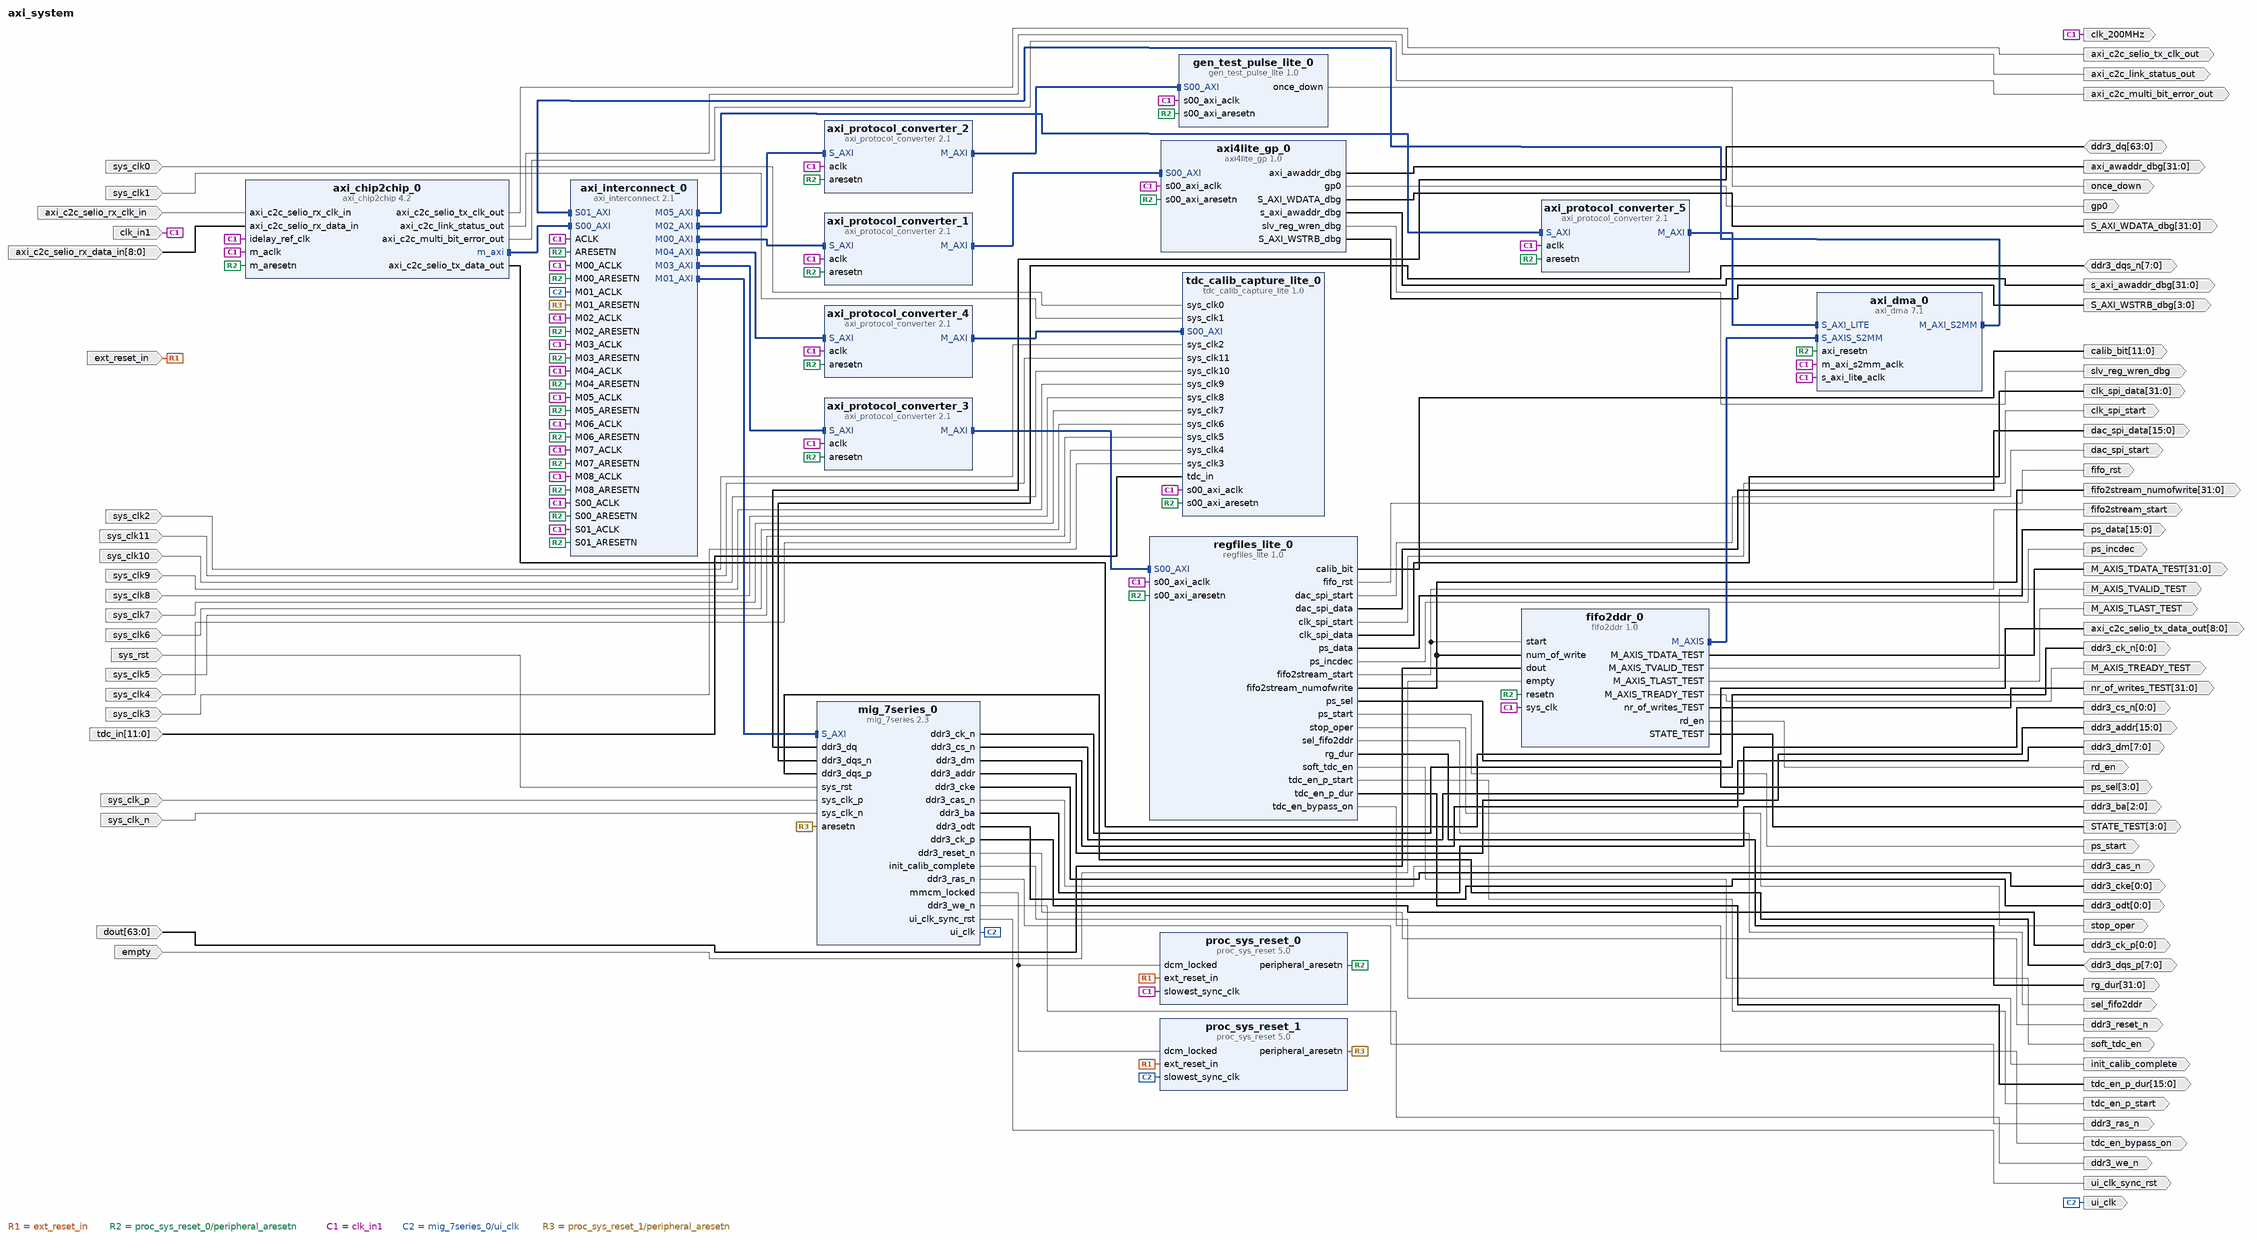
[diagram p0: block diagram of the top level]
# Vivado block design axi_system, Vivado 2015.2
create_bd_design axi_system

create_bd_port -dir I -type rst ext_reset_in
create_bd_port -dir I -type clk axi_c2c_selio_rx_clk_in
set_property -dict {CONFIG.FREQ_HZ 200000000} [get_bd_ports axi_c2c_selio_rx_clk_in]
create_bd_port -dir O -type clk axi_c2c_selio_tx_clk_out
create_bd_port -dir O axi_c2c_link_status_out
create_bd_port -dir O axi_c2c_multi_bit_error_out
create_bd_port -dir O gp0
create_bd_port -dir O slv_reg_wren_dbg
create_bd_port -dir O -from 31 -to 0 S_AXI_WDATA_dbg
create_bd_port -dir O -from 3 -to 0 S_AXI_WSTRB_dbg
create_bd_port -dir O -from 31 -to 0 axi_awaddr_dbg
create_bd_port -dir O -from 31 -to 0 s_axi_awaddr_dbg
create_bd_port -dir O init_calib_complete
create_bd_port -dir I -type rst sys_rst
create_bd_port -dir IO -from 63 -to 0 ddr3_dq
create_bd_port -dir O -from 0 -to 0 ddr3_odt
create_bd_port -dir O -from 7 -to 0 ddr3_dm
create_bd_port -dir O -from 0 -to 0 ddr3_cs_n
create_bd_port -dir O -from 0 -to 0 ddr3_cke
create_bd_port -dir O -from 0 -to 0 ddr3_ck_n
create_bd_port -dir O -from 0 -to 0 ddr3_ck_p
create_bd_port -dir O ddr3_reset_n
create_bd_port -dir O ddr3_we_n
create_bd_port -dir O ddr3_cas_n
create_bd_port -dir O ddr3_ras_n
create_bd_port -dir O -from 2 -to 0 ddr3_ba
create_bd_port -dir O -from 15 -to 0 ddr3_addr
create_bd_port -dir IO -from 7 -to 0 ddr3_dqs_n
create_bd_port -dir IO -from 7 -to 0 ddr3_dqs_p
create_bd_port -dir O once_down
create_bd_port -dir O fifo_rst
create_bd_port -dir O ps_start
create_bd_port -dir O -from 15 -to 0 ps_data
create_bd_port -dir O -from 3 -to 0 ps_sel
create_bd_port -dir O ps_incdec
create_bd_port -dir O stop_oper
create_bd_port -dir O fifo2stream_start
create_bd_port -dir O -from 31 -to 0 fifo2stream_numofwrite
create_bd_port -dir O sel_fifo2ddr
create_bd_port -dir O soft_tdc_en
create_bd_port -dir O -from 31 -to 0 rg_dur
create_bd_port -dir O tdc_en_p_start
create_bd_port -dir O -from 15 -to 0 tdc_en_p_dur
create_bd_port -dir I sys_clk0
create_bd_port -dir I sys_clk1
create_bd_port -dir I sys_clk2
create_bd_port -dir I sys_clk11
create_bd_port -dir I sys_clk10
create_bd_port -dir I sys_clk9
create_bd_port -dir I sys_clk8
create_bd_port -dir I sys_clk7
create_bd_port -dir I sys_clk6
create_bd_port -dir I sys_clk5
create_bd_port -dir I sys_clk4
create_bd_port -dir I sys_clk3
create_bd_port -dir I -from 11 -to 0 tdc_in
create_bd_port -dir I -from 63 -to 0 dout
create_bd_port -dir I empty
create_bd_port -dir O rd_en
create_bd_port -dir O M_AXIS_TVALID_TEST
create_bd_port -dir O -from 31 -to 0 M_AXIS_TDATA_TEST
create_bd_port -dir O M_AXIS_TREADY_TEST
create_bd_port -dir O M_AXIS_TLAST_TEST
create_bd_port -dir O -from 3 -to 0 STATE_TEST
create_bd_port -dir O -from 31 -to 0 nr_of_writes_TEST
create_bd_port -dir O -from 8 -to 0 axi_c2c_selio_tx_data_out
create_bd_port -dir I -from 8 -to 0 axi_c2c_selio_rx_data_in
create_bd_port -dir O -from 11 -to 0 calib_bit
create_bd_port -dir O tdc_en_bypass_on
create_bd_port -dir O dac_spi_start
create_bd_port -dir O -from 15 -to 0 dac_spi_data
create_bd_port -dir I -type clk clk_in1
set_property -dict [list \
  CONFIG.FREQ_HZ 200000000 \
  CONFIG.PHASE 0 \
  CONFIG.CLK_DOMAIN axi_system_mig_7series_0_0_ui_clk \
] [get_bd_ports clk_in1]
create_bd_port -dir O -type clk clk_200MHz
create_bd_port -dir O ui_clk
create_bd_port -dir O -type rst ui_clk_sync_rst
create_bd_port -dir O clk_spi_start
create_bd_port -dir O -from 31 -to 0 clk_spi_data
create_bd_port -dir I sys_clk_p
create_bd_port -dir I sys_clk_n

create_bd_cell -type ip -vlnv fedadesign.com:fedalib:axi4lite_gp:1.0 axi4lite_gp_0
create_bd_cell -type ip -vlnv fedadesign.com:fedalib:gen_test_pulse_lite:1.0 gen_test_pulse_lite_0
create_bd_cell -type ip -vlnv fedadesign.com:fedalib:tdc_calib_capture_lite:1.0 tdc_calib_capture_lite_0
create_bd_cell -type ip -vlnv xilinx.com:ip:axi_chip2chip:4.2 axi_chip2chip_0
set_property -dict [list \
  CONFIG.C_AXI_WUSER_WIDTH 4 \
  CONFIG.C_AXI_ID_WIDTH 6 \
  CONFIG.C_AXI_DATA_WIDTH 32 \
  CONFIG.C_INCLUDE_AXILITE 0 \
  CONFIG.C_INTERFACE_MODE 2 \
  CONFIG.C_INTERFACE_TYPE 1 \
  CONFIG.C_COMMON_CLK 0 \
  CONFIG.C_MASTER_FPGA 0 \
  CONFIG.C_ECC_ENABLE true \
  CONFIG.C_AURORA_WIDTH 2 \
  CONFIG.C_USE_DIFF_IO false \
  CONFIG.C_USE_DIFF_CLK false \
  CONFIG.C_DISABLE_CLK_SHIFT false \
  CONFIG.C_DISABLE_DESKEW false \
] [get_bd_cells axi_chip2chip_0]
create_bd_cell -type ip -vlnv xilinx.com:ip:axi_dma:7.1 axi_dma_0
set_property -dict [list \
  CONFIG.c_include_sg 0 \
  CONFIG.c_sg_length_width 23 \
  CONFIG.c_micro_dma 0 \
  CONFIG.c_include_mm2s 0 \
  CONFIG.c_s2mm_burst_size 128 \
] [get_bd_cells axi_dma_0]
create_bd_cell -type ip -vlnv xilinx.com:ip:axi_interconnect:2.1 axi_interconnect_0
set_property -dict [list \
  CONFIG.NUM_SI 2 \
  CONFIG.NUM_MI 9 \
  CONFIG.STRATEGY 2 \
  CONFIG.ENABLE_ADVANCED_OPTIONS 1 \
  CONFIG.ENABLE_PROTOCOL_CHECKERS 0 \
  CONFIG.SYNCHRONIZATION_STAGES 2 \
  CONFIG.M01_HAS_DATA_FIFO 2 \
] [get_bd_cells axi_interconnect_0]
create_bd_cell -type ip -vlnv xilinx.com:ip:axi_protocol_converter:2.1 axi_protocol_converter_1
create_bd_cell -type ip -vlnv xilinx.com:ip:axi_protocol_converter:2.1 axi_protocol_converter_2
create_bd_cell -type ip -vlnv xilinx.com:ip:axi_protocol_converter:2.1 axi_protocol_converter_3
create_bd_cell -type ip -vlnv xilinx.com:ip:axi_protocol_converter:2.1 axi_protocol_converter_4
create_bd_cell -type ip -vlnv xilinx.com:ip:axi_protocol_converter:2.1 axi_protocol_converter_5
create_bd_cell -type ip -vlnv xilinx.com:ip:mig_7series:2.3 mig_7series_0
set_property -dict [list \
  CONFIG.XML_INPUT_FILE mig_a.prj \
  CONFIG.RESET_BOARD_INTERFACE Custom \
  CONFIG.BOARD_MIG_PARAM Custom \
] [get_bd_cells mig_7series_0]
create_bd_cell -type ip -vlnv xilinx.com:ip:proc_sys_reset:5.0 proc_sys_reset_0
create_bd_cell -type ip -vlnv fedadesign.com:fedalib:regfiles_lite:1.0 regfiles_lite_0
create_bd_cell -type ip -vlnv fedadesign.com:fedalib:fifo2ddr:1.0 fifo2ddr_0
create_bd_cell -type ip -vlnv xilinx.com:ip:proc_sys_reset:5.0 proc_sys_reset_1

# ---- connections ----

connect_bd_intf_net [get_bd_intf_pins axi_protocol_converter_1/M_AXI] [get_bd_intf_pins axi4lite_gp_0/S00_AXI]
connect_bd_intf_net [get_bd_intf_pins axi_protocol_converter_1/S_AXI] [get_bd_intf_pins axi_interconnect_0/M00_AXI]
connect_bd_intf_net [get_bd_intf_pins mig_7series_0/S_AXI] [get_bd_intf_pins axi_interconnect_0/M01_AXI]
connect_bd_intf_net [get_bd_intf_pins axi_protocol_converter_2/M_AXI] [get_bd_intf_pins gen_test_pulse_lite_0/S00_AXI]
connect_bd_intf_net [get_bd_intf_pins axi_protocol_converter_2/S_AXI] [get_bd_intf_pins axi_interconnect_0/M02_AXI]
connect_bd_intf_net [get_bd_intf_pins axi_protocol_converter_3/M_AXI] [get_bd_intf_pins regfiles_lite_0/S00_AXI]
connect_bd_intf_net [get_bd_intf_pins axi_protocol_converter_3/S_AXI] [get_bd_intf_pins axi_interconnect_0/M03_AXI]
connect_bd_intf_net [get_bd_intf_pins axi_protocol_converter_4/M_AXI] [get_bd_intf_pins tdc_calib_capture_lite_0/S00_AXI]
connect_bd_intf_net [get_bd_intf_pins axi_protocol_converter_4/S_AXI] [get_bd_intf_pins axi_interconnect_0/M04_AXI]
connect_bd_intf_net [get_bd_intf_pins axi_dma_0/M_AXI_S2MM] [get_bd_intf_pins axi_interconnect_0/S01_AXI]
connect_bd_intf_net [get_bd_intf_pins fifo2ddr_0/M_AXIS] [get_bd_intf_pins axi_dma_0/S_AXIS_S2MM]
connect_bd_intf_net [get_bd_intf_pins axi_protocol_converter_5/M_AXI] [get_bd_intf_pins axi_dma_0/S_AXI_LITE]
connect_bd_intf_net [get_bd_intf_pins axi_protocol_converter_5/S_AXI] [get_bd_intf_pins axi_interconnect_0/M05_AXI]
connect_bd_intf_net [get_bd_intf_pins axi_interconnect_0/S00_AXI] [get_bd_intf_pins axi_chip2chip_0/m_axi]
connect_bd_net [get_bd_ports ext_reset_in] [get_bd_pins proc_sys_reset_0/ext_reset_in] [get_bd_pins proc_sys_reset_1/ext_reset_in]
connect_bd_net [get_bd_ports axi_c2c_selio_rx_clk_in] [get_bd_pins axi_chip2chip_0/axi_c2c_selio_rx_clk_in]
connect_bd_net [get_bd_pins axi_chip2chip_0/axi_c2c_selio_tx_clk_out] [get_bd_ports axi_c2c_selio_tx_clk_out]
connect_bd_net [get_bd_pins axi_chip2chip_0/axi_c2c_link_status_out] [get_bd_ports axi_c2c_link_status_out]
connect_bd_net [get_bd_pins axi_chip2chip_0/axi_c2c_multi_bit_error_out] [get_bd_ports axi_c2c_multi_bit_error_out]
connect_bd_net [get_bd_pins axi4lite_gp_0/gp0] [get_bd_ports gp0]
connect_bd_net [get_bd_pins axi4lite_gp_0/slv_reg_wren_dbg] [get_bd_ports slv_reg_wren_dbg]
connect_bd_net [get_bd_pins axi4lite_gp_0/S_AXI_WDATA_dbg] [get_bd_ports S_AXI_WDATA_dbg]
connect_bd_net [get_bd_pins axi4lite_gp_0/S_AXI_WSTRB_dbg] [get_bd_ports S_AXI_WSTRB_dbg]
connect_bd_net [get_bd_pins axi4lite_gp_0/axi_awaddr_dbg] [get_bd_ports axi_awaddr_dbg]
connect_bd_net [get_bd_pins axi4lite_gp_0/s_axi_awaddr_dbg] [get_bd_ports s_axi_awaddr_dbg]
connect_bd_net [get_bd_pins proc_sys_reset_0/peripheral_aresetn] \
  [get_bd_pins axi4lite_gp_0/s00_axi_aresetn] [get_bd_pins gen_test_pulse_lite_0/s00_axi_aresetn] \
  [get_bd_pins tdc_calib_capture_lite_0/s00_axi_aresetn] [get_bd_pins axi_chip2chip_0/m_aresetn] \
  [get_bd_pins axi_dma_0/axi_resetn] [get_bd_pins axi_protocol_converter_1/aresetn] \
  [get_bd_pins axi_protocol_converter_2/aresetn] [get_bd_pins axi_protocol_converter_3/aresetn] \
  [get_bd_pins axi_protocol_converter_4/aresetn] [get_bd_pins axi_protocol_converter_5/aresetn] \
  [get_bd_pins regfiles_lite_0/s00_axi_aresetn] [get_bd_pins fifo2ddr_0/resetn] [get_bd_pins axi_interconnect_0/ARESETN] \
  [get_bd_pins axi_interconnect_0/S00_ARESETN] [get_bd_pins axi_interconnect_0/M00_ARESETN] \
  [get_bd_pins axi_interconnect_0/M02_ARESETN] [get_bd_pins axi_interconnect_0/M03_ARESETN] \
  [get_bd_pins axi_interconnect_0/M04_ARESETN] [get_bd_pins axi_interconnect_0/M05_ARESETN] \
  [get_bd_pins axi_interconnect_0/S01_ARESETN] [get_bd_pins axi_interconnect_0/M06_ARESETN] \
  [get_bd_pins axi_interconnect_0/M07_ARESETN] [get_bd_pins axi_interconnect_0/M08_ARESETN]
connect_bd_net [get_bd_pins mig_7series_0/init_calib_complete] [get_bd_ports init_calib_complete]
connect_bd_net [get_bd_ports sys_rst] [get_bd_pins mig_7series_0/sys_rst]
connect_bd_net [get_bd_ports ddr3_dq] [get_bd_pins mig_7series_0/ddr3_dq]
connect_bd_net [get_bd_pins mig_7series_0/ddr3_odt] [get_bd_ports ddr3_odt]
connect_bd_net [get_bd_pins mig_7series_0/ddr3_dm] [get_bd_ports ddr3_dm]
connect_bd_net [get_bd_pins mig_7series_0/ddr3_cs_n] [get_bd_ports ddr3_cs_n]
connect_bd_net [get_bd_pins mig_7series_0/ddr3_cke] [get_bd_ports ddr3_cke]
connect_bd_net [get_bd_pins mig_7series_0/ddr3_ck_n] [get_bd_ports ddr3_ck_n]
connect_bd_net [get_bd_pins mig_7series_0/ddr3_ck_p] [get_bd_ports ddr3_ck_p]
connect_bd_net [get_bd_pins mig_7series_0/ddr3_reset_n] [get_bd_ports ddr3_reset_n]
connect_bd_net [get_bd_pins mig_7series_0/ddr3_we_n] [get_bd_ports ddr3_we_n]
connect_bd_net [get_bd_pins mig_7series_0/ddr3_cas_n] [get_bd_ports ddr3_cas_n]
connect_bd_net [get_bd_pins mig_7series_0/ddr3_ras_n] [get_bd_ports ddr3_ras_n]
connect_bd_net [get_bd_pins mig_7series_0/ddr3_ba] [get_bd_ports ddr3_ba]
connect_bd_net [get_bd_pins mig_7series_0/ddr3_addr] [get_bd_ports ddr3_addr]
connect_bd_net [get_bd_ports ddr3_dqs_n] [get_bd_pins mig_7series_0/ddr3_dqs_n]
connect_bd_net [get_bd_ports ddr3_dqs_p] [get_bd_pins mig_7series_0/ddr3_dqs_p]
connect_bd_net [get_bd_pins gen_test_pulse_lite_0/once_down] [get_bd_ports once_down]
connect_bd_net [get_bd_pins regfiles_lite_0/fifo_rst] [get_bd_ports fifo_rst]
connect_bd_net [get_bd_pins regfiles_lite_0/ps_start] [get_bd_ports ps_start]
connect_bd_net [get_bd_pins regfiles_lite_0/ps_data] [get_bd_ports ps_data]
connect_bd_net [get_bd_pins regfiles_lite_0/ps_sel] [get_bd_ports ps_sel]
connect_bd_net [get_bd_pins regfiles_lite_0/ps_incdec] [get_bd_ports ps_incdec]
connect_bd_net [get_bd_pins regfiles_lite_0/stop_oper] [get_bd_ports stop_oper]
connect_bd_net [get_bd_pins regfiles_lite_0/fifo2stream_start] [get_bd_ports fifo2stream_start] [get_bd_pins fifo2ddr_0/start]
connect_bd_net [get_bd_pins regfiles_lite_0/fifo2stream_numofwrite] [get_bd_ports fifo2stream_numofwrite] [get_bd_pins fifo2ddr_0/num_of_write]
connect_bd_net [get_bd_pins regfiles_lite_0/sel_fifo2ddr] [get_bd_ports sel_fifo2ddr]
connect_bd_net [get_bd_pins regfiles_lite_0/soft_tdc_en] [get_bd_ports soft_tdc_en]
connect_bd_net [get_bd_pins regfiles_lite_0/rg_dur] [get_bd_ports rg_dur]
connect_bd_net [get_bd_pins regfiles_lite_0/tdc_en_p_start] [get_bd_ports tdc_en_p_start]
connect_bd_net [get_bd_pins regfiles_lite_0/tdc_en_p_dur] [get_bd_ports tdc_en_p_dur]
connect_bd_net -net sys_clk0_1 [get_bd_ports sys_clk0] [get_bd_pins tdc_calib_capture_lite_0/sys_clk0]
connect_bd_net -net sys_clk1_1 [get_bd_ports sys_clk1] [get_bd_pins tdc_calib_capture_lite_0/sys_clk1]
connect_bd_net -net sys_clk2_1 [get_bd_ports sys_clk2] [get_bd_pins tdc_calib_capture_lite_0/sys_clk2]
connect_bd_net -net sys_clk11_1 [get_bd_ports sys_clk11] [get_bd_pins tdc_calib_capture_lite_0/sys_clk11]
connect_bd_net -net sys_clk10_1 [get_bd_ports sys_clk10] [get_bd_pins tdc_calib_capture_lite_0/sys_clk10]
connect_bd_net -net sys_clk9_1 [get_bd_ports sys_clk9] [get_bd_pins tdc_calib_capture_lite_0/sys_clk9]
connect_bd_net -net sys_clk8_1 [get_bd_ports sys_clk8] [get_bd_pins tdc_calib_capture_lite_0/sys_clk8]
connect_bd_net -net sys_clk7_1 [get_bd_ports sys_clk7] [get_bd_pins tdc_calib_capture_lite_0/sys_clk7]
connect_bd_net -net sys_clk6_1 [get_bd_ports sys_clk6] [get_bd_pins tdc_calib_capture_lite_0/sys_clk6]
connect_bd_net -net sys_clk5_1 [get_bd_ports sys_clk5] [get_bd_pins tdc_calib_capture_lite_0/sys_clk5]
connect_bd_net -net sys_clk4_1 [get_bd_ports sys_clk4] [get_bd_pins tdc_calib_capture_lite_0/sys_clk4]
connect_bd_net -net sys_clk3_1 [get_bd_ports sys_clk3] [get_bd_pins tdc_calib_capture_lite_0/sys_clk3]
connect_bd_net [get_bd_ports tdc_in] [get_bd_pins tdc_calib_capture_lite_0/tdc_in]
connect_bd_net [get_bd_ports dout] [get_bd_pins fifo2ddr_0/dout]
connect_bd_net [get_bd_ports empty] [get_bd_pins fifo2ddr_0/empty]
connect_bd_net [get_bd_pins fifo2ddr_0/rd_en] [get_bd_ports rd_en]
connect_bd_net [get_bd_pins fifo2ddr_0/M_AXIS_TVALID_TEST] [get_bd_ports M_AXIS_TVALID_TEST]
connect_bd_net [get_bd_pins fifo2ddr_0/M_AXIS_TDATA_TEST] [get_bd_ports M_AXIS_TDATA_TEST]
connect_bd_net [get_bd_pins fifo2ddr_0/M_AXIS_TREADY_TEST] [get_bd_ports M_AXIS_TREADY_TEST]
connect_bd_net [get_bd_pins fifo2ddr_0/M_AXIS_TLAST_TEST] [get_bd_ports M_AXIS_TLAST_TEST]
connect_bd_net [get_bd_pins fifo2ddr_0/STATE_TEST] [get_bd_ports STATE_TEST]
connect_bd_net [get_bd_pins fifo2ddr_0/nr_of_writes_TEST] [get_bd_ports nr_of_writes_TEST]
connect_bd_net [get_bd_pins axi_chip2chip_0/axi_c2c_selio_tx_data_out] [get_bd_ports axi_c2c_selio_tx_data_out]
connect_bd_net [get_bd_ports axi_c2c_selio_rx_data_in] [get_bd_pins axi_chip2chip_0/axi_c2c_selio_rx_data_in]
connect_bd_net [get_bd_pins regfiles_lite_0/calib_bit] [get_bd_ports calib_bit]
connect_bd_net [get_bd_pins regfiles_lite_0/tdc_en_bypass_on] [get_bd_ports tdc_en_bypass_on]
connect_bd_net [get_bd_pins regfiles_lite_0/dac_spi_start] [get_bd_ports dac_spi_start]
connect_bd_net [get_bd_pins regfiles_lite_0/dac_spi_data] [get_bd_ports dac_spi_data]
connect_bd_net -net clk_in1_1 [get_bd_ports clk_in1] \
  [get_bd_ports clk_200MHz] [get_bd_pins gen_test_pulse_lite_0/s00_axi_aclk] \
  [get_bd_pins tdc_calib_capture_lite_0/s00_axi_aclk] [get_bd_pins axi4lite_gp_0/s00_axi_aclk] \
  [get_bd_pins axi_chip2chip_0/m_aclk] [get_bd_pins axi_dma_0/s_axi_lite_aclk] [get_bd_pins axi_dma_0/m_axi_s2mm_aclk] \
  [get_bd_pins axi_protocol_converter_1/aclk] [get_bd_pins axi_protocol_converter_2/aclk] \
  [get_bd_pins axi_protocol_converter_3/aclk] [get_bd_pins axi_protocol_converter_4/aclk] \
  [get_bd_pins axi_protocol_converter_5/aclk] [get_bd_pins proc_sys_reset_0/slowest_sync_clk] \
  [get_bd_pins regfiles_lite_0/s00_axi_aclk] [get_bd_pins fifo2ddr_0/sys_clk] [get_bd_pins axi_chip2chip_0/idelay_ref_clk] \
  [get_bd_pins axi_interconnect_0/ACLK] [get_bd_pins axi_interconnect_0/S00_ACLK] [get_bd_pins axi_interconnect_0/M00_ACLK] \
  [get_bd_pins axi_interconnect_0/M02_ACLK] [get_bd_pins axi_interconnect_0/M03_ACLK] \
  [get_bd_pins axi_interconnect_0/M04_ACLK] [get_bd_pins axi_interconnect_0/M05_ACLK] \
  [get_bd_pins axi_interconnect_0/S01_ACLK] [get_bd_pins axi_interconnect_0/M06_ACLK] \
  [get_bd_pins axi_interconnect_0/M07_ACLK] [get_bd_pins axi_interconnect_0/M08_ACLK]
connect_bd_net [get_bd_pins mig_7series_0/ui_clk] \
  [get_bd_ports ui_clk] [get_bd_pins proc_sys_reset_1/slowest_sync_clk] [get_bd_pins axi_interconnect_0/M01_ACLK]
connect_bd_net [get_bd_pins mig_7series_0/ui_clk_sync_rst] [get_bd_ports ui_clk_sync_rst]
connect_bd_net [get_bd_pins mig_7series_0/mmcm_locked] [get_bd_pins proc_sys_reset_0/dcm_locked] [get_bd_pins proc_sys_reset_1/dcm_locked]
connect_bd_net [get_bd_pins regfiles_lite_0/clk_spi_start] [get_bd_ports clk_spi_start]
connect_bd_net [get_bd_pins regfiles_lite_0/clk_spi_data] [get_bd_ports clk_spi_data]
connect_bd_net -net M01_ARESETN_1 [get_bd_pins proc_sys_reset_1/peripheral_aresetn] \
  [get_bd_pins mig_7series_0/aresetn] [get_bd_pins axi_interconnect_0/M01_ARESETN]
connect_bd_net [get_bd_ports sys_clk_p] [get_bd_pins mig_7series_0/sys_clk_p]
connect_bd_net [get_bd_ports sys_clk_n] [get_bd_pins mig_7series_0/sys_clk_n]

# ---- address map ----
assign_bd_address -offset 0x50000000 -range 4K -target_address_space [get_bd_addr_spaces axi_chip2chip_0/MAXI] [get_bd_addr_segs axi4lite_gp_0/S00_AXI/S00_AXI_reg]
assign_bd_address -offset 0x50001000 -range 4K -target_address_space [get_bd_addr_spaces axi_chip2chip_0/MAXI] [get_bd_addr_segs gen_test_pulse_lite_0/S00_AXI/S00_AXI_reg]
assign_bd_address -offset 0x50002000 -range 4K -target_address_space [get_bd_addr_spaces axi_chip2chip_0/MAXI] [get_bd_addr_segs regfiles_lite_0/S00_AXI/S00_AXI_reg]
assign_bd_address -offset 0x50003000 -range 4K -target_address_space [get_bd_addr_spaces axi_chip2chip_0/MAXI] [get_bd_addr_segs tdc_calib_capture_lite_0/S00_AXI/S00_AXI_reg]
assign_bd_address -offset 0x51000000 -range 64K -target_address_space [get_bd_addr_spaces axi_chip2chip_0/MAXI] [get_bd_addr_segs axi_dma_0/S_AXI_LITE/Reg]
assign_bd_address -offset 0x60000000 -range 512M -target_address_space [get_bd_addr_spaces axi_chip2chip_0/MAXI] [get_bd_addr_segs mig_7series_0/memmap/memaddr]
assign_bd_address -offset 0x50000000 -range 4K -target_address_space [get_bd_addr_spaces axi_dma_0/Data_S2MM] [get_bd_addr_segs axi4lite_gp_0/S00_AXI/S00_AXI_reg]
assign_bd_address -offset 0x50001000 -range 4K -target_address_space [get_bd_addr_spaces axi_dma_0/Data_S2MM] [get_bd_addr_segs gen_test_pulse_lite_0/S00_AXI/S00_AXI_reg]
assign_bd_address -offset 0x50002000 -range 4K -target_address_space [get_bd_addr_spaces axi_dma_0/Data_S2MM] [get_bd_addr_segs regfiles_lite_0/S00_AXI/S00_AXI_reg]
assign_bd_address -offset 0x50003000 -range 4K -target_address_space [get_bd_addr_spaces axi_dma_0/Data_S2MM] [get_bd_addr_segs tdc_calib_capture_lite_0/S00_AXI/S00_AXI_reg]
assign_bd_address -offset 0x51000000 -range 64K -target_address_space [get_bd_addr_spaces axi_dma_0/Data_S2MM] [get_bd_addr_segs axi_dma_0/S_AXI_LITE/Reg]
assign_bd_address -offset 0x60000000 -range 512M -target_address_space [get_bd_addr_spaces axi_dma_0/Data_S2MM] [get_bd_addr_segs mig_7series_0/memmap/memaddr]

validate_bd_design
save_bd_design
